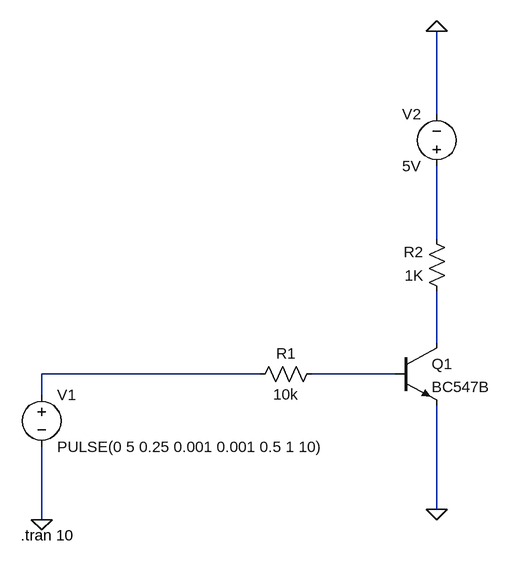
[diagram p0: schematic fonction-logique-NON.asc]
fonction-logique-NON.asc, the LTspice schematic file:
Version 4.1
SHEET 1 880 680
WIRE 368 -176 368 -304
WIRE 368 16 368 -96
WIRE 368 176 368 96
WIRE 96 224 -240 224
WIRE 304 224 176 224
WIRE -240 256 -240 224
WIRE 368 432 368 272
WIRE -240 448 -240 336
FLAG 368 -304 0
FLAG 368 432 0
FLAG -240 448 0
SYMBOL npn 304 176 R0
SYMATTR InstName Q1
SYMATTR Value BC547B
SYMBOL res 192 208 R90
WINDOW 0 0 56 VBottom 2
WINDOW 3 32 56 VTop 2
SYMATTR InstName R1
SYMATTR Value 10k
SYMBOL res 384 112 R180
WINDOW 0 36 76 Left 2
WINDOW 3 36 40 Left 2
SYMATTR InstName R2
SYMATTR Value 1K
SYMBOL voltage -240 240 R0
WINDOW 123 0 0 Left 0
WINDOW 39 0 0 Left 0
SYMATTR InstName V1
SYMATTR Value PULSE(0 5 0.25 0.001 0.001 0.5 1 10)
SYMBOL voltage 368 -80 R180
WINDOW 0 24 96 Left 2
WINDOW 3 24 16 Left 2
WINDOW 123 0 0 Left 0
WINDOW 39 0 0 Left 0
SYMATTR InstName V2
SYMATTR Value 5V
TEXT -272 472 Left 2 !.tran 10

The netlist it stands for:
* fonction-logique-NON.asc
Q1 N002 N004 0 0 BC547B
R1 N004 N003 10k
R2 N002 N001 1K
V1 N003 0 PULSE(0 5 0.25 0.001 0.001 0.5 1 10)
V2 N001 0 5V
.model NPN NPN
.model PNP PNP
.lib standard.bjt
.tran 10
.backanno
.end